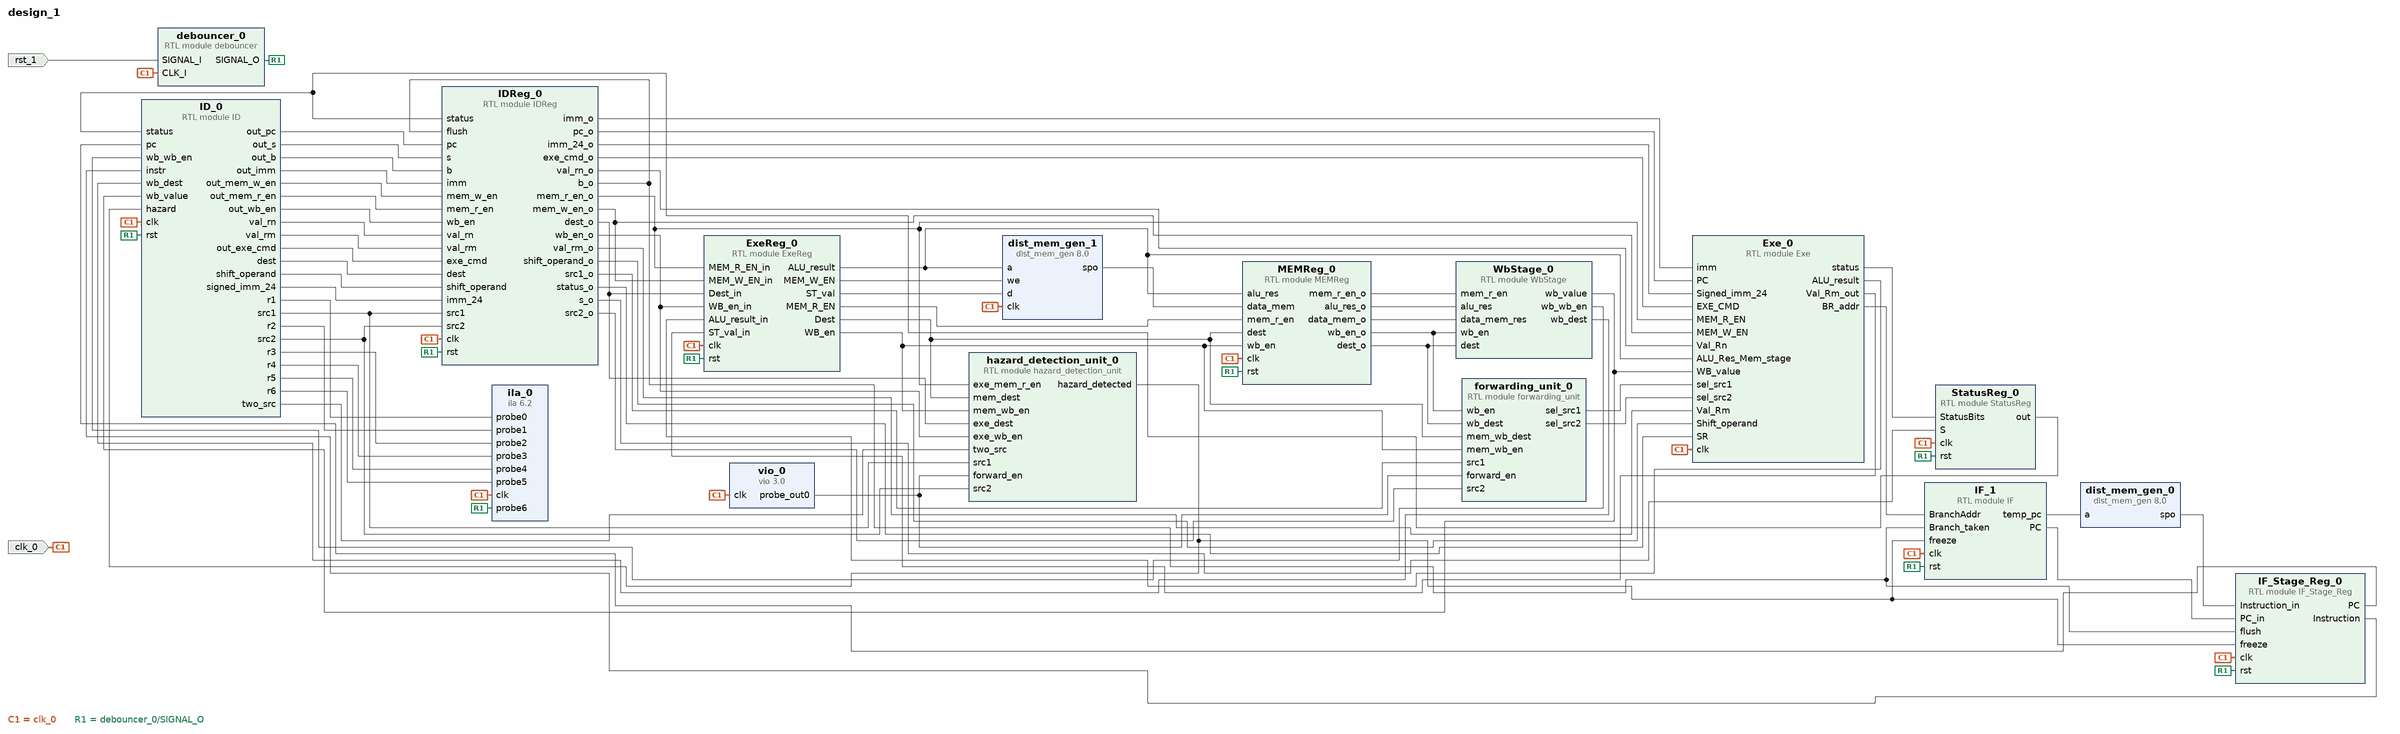
[diagram p0: block diagram of the top level]
# Vivado block design design_1, xc7z010clg400-1, Vivado 2018.3
create_bd_design design_1

create_bd_port -dir I -type clk clk_0
create_bd_port -dir I -type rst rst_1

create_bd_cell -type module -reference IF_Stage_Reg IF_Stage_Reg_0
create_bd_cell -type module -reference IF IF_1
create_bd_cell -type module -reference ExeReg ExeReg_0
create_bd_cell -type ip -vlnv xilinx.com:ip:dist_mem_gen:8.0 dist_mem_gen_0
set_property -dict [list \
  CONFIG.coefficient_file ../../../../../../vivado_phase1/output_ultimate.coe \
  CONFIG.data_width 32 \
  CONFIG.depth 8192 \
  CONFIG.memory_type rom \
] [get_bd_cells dist_mem_gen_0]
create_bd_cell -type ip -vlnv xilinx.com:ip:dist_mem_gen:8.0 dist_mem_gen_1
set_property -dict {CONFIG.data_width 32 CONFIG.depth 8192 CONFIG.memory_type single_port_ram} [get_bd_cells dist_mem_gen_1]
create_bd_cell -type module -reference MEMReg MEMReg_0
create_bd_cell -type module -reference WbStage WbStage_0
create_bd_cell -type module -reference StatusReg StatusReg_0
create_bd_cell -type ip -vlnv xilinx.com:ip:ila:6.2 ila_0
set_property -dict [list \
  CONFIG.C_ENABLE_ILA_AXI_MON false \
  CONFIG.C_MONITOR_TYPE Native \
  CONFIG.C_NUM_OF_PROBES 7 \
  CONFIG.C_PROBE0_TYPE 1 \
  CONFIG.C_PROBE0_WIDTH 32 \
  CONFIG.C_PROBE1_TYPE 1 \
  CONFIG.C_PROBE1_WIDTH 32 \
  CONFIG.C_PROBE2_TYPE 1 \
  CONFIG.C_PROBE2_WIDTH 32 \
  CONFIG.C_PROBE3_TYPE 1 \
  CONFIG.C_PROBE3_WIDTH 32 \
  CONFIG.C_PROBE4_TYPE 1 \
  CONFIG.C_PROBE4_WIDTH 32 \
  CONFIG.C_PROBE5_TYPE 1 \
  CONFIG.C_PROBE5_WIDTH 32 \
  CONFIG.C_PROBE6_TYPE 2 \
] [get_bd_cells ila_0]
create_bd_cell -type module -reference ID ID_0
create_bd_cell -type module -reference IDReg IDReg_0
create_bd_cell -type module -reference Exe Exe_0
create_bd_cell -type module -reference forwarding_unit forwarding_unit_0
create_bd_cell -type ip -vlnv xilinx.com:ip:vio:3.0 vio_0
set_property -dict {CONFIG.C_NUM_PROBE_IN 0} [get_bd_cells vio_0]
create_bd_cell -type module -reference debouncer debouncer_0
create_bd_cell -type module -reference hazard_detection_unit hazard_detection_unit_0

# ---- connections ----

connect_bd_net -net clk_0_1 [get_bd_ports clk_0] \
  [get_bd_pins IF_Stage_Reg_0/clk] [get_bd_pins IF_1/clk] [get_bd_pins ExeReg_0/clk] [get_bd_pins MEMReg_0/clk] \
  [get_bd_pins dist_mem_gen_1/clk] [get_bd_pins StatusReg_0/clk] [get_bd_pins ila_0/clk] [get_bd_pins ID_0/clk] \
  [get_bd_pins IDReg_0/clk] [get_bd_pins Exe_0/clk] [get_bd_pins vio_0/clk] [get_bd_pins debouncer_0/CLK_I]
connect_bd_net [get_bd_pins IF_1/PC] [get_bd_pins IF_Stage_Reg_0/PC_in]
connect_bd_net [get_bd_pins ID_0/out_pc] [get_bd_pins IDReg_0/pc]
connect_bd_net [get_bd_pins IF_Stage_Reg_0/PC] [get_bd_pins ID_0/pc]
connect_bd_net [get_bd_pins IF_Stage_Reg_0/Instruction] [get_bd_pins ID_0/instr]
connect_bd_net [get_bd_pins ID_0/out_s] [get_bd_pins IDReg_0/s]
connect_bd_net [get_bd_pins ID_0/out_b] [get_bd_pins IDReg_0/b]
connect_bd_net [get_bd_pins ID_0/out_imm] [get_bd_pins IDReg_0/imm]
connect_bd_net [get_bd_pins ID_0/out_mem_w_en] [get_bd_pins IDReg_0/mem_w_en]
connect_bd_net [get_bd_pins ID_0/out_mem_r_en] [get_bd_pins IDReg_0/mem_r_en]
connect_bd_net [get_bd_pins ID_0/out_wb_en] [get_bd_pins IDReg_0/wb_en]
connect_bd_net [get_bd_pins ID_0/val_rn] [get_bd_pins IDReg_0/val_rn]
connect_bd_net [get_bd_pins ID_0/val_rm] [get_bd_pins IDReg_0/val_rm]
connect_bd_net [get_bd_pins ID_0/out_exe_cmd] [get_bd_pins IDReg_0/exe_cmd]
connect_bd_net [get_bd_pins ID_0/dest] [get_bd_pins IDReg_0/dest]
connect_bd_net [get_bd_pins ID_0/shift_operand] [get_bd_pins IDReg_0/shift_operand]
connect_bd_net [get_bd_pins ID_0/signed_imm_24] [get_bd_pins IDReg_0/imm_24]
connect_bd_net [get_bd_pins dist_mem_gen_0/spo] [get_bd_pins IF_Stage_Reg_0/Instruction_in]
connect_bd_net [get_bd_pins IF_1/temp_pc] [get_bd_pins dist_mem_gen_0/a]
connect_bd_net [get_bd_pins IDReg_0/imm_o] [get_bd_pins Exe_0/imm]
connect_bd_net [get_bd_pins IDReg_0/pc_o] [get_bd_pins Exe_0/PC]
connect_bd_net [get_bd_pins IDReg_0/imm_24_o] [get_bd_pins Exe_0/Signed_imm_24]
connect_bd_net [get_bd_pins IDReg_0/exe_cmd_o] [get_bd_pins Exe_0/EXE_CMD]
connect_bd_net [get_bd_pins IDReg_0/mem_r_en_o] \
  [get_bd_pins ExeReg_0/MEM_R_EN_in] [get_bd_pins Exe_0/MEM_R_EN] [get_bd_pins hazard_detection_unit_0/exe_mem_r_en]
connect_bd_net [get_bd_pins IDReg_0/mem_w_en_o] [get_bd_pins ExeReg_0/MEM_W_EN_in] [get_bd_pins Exe_0/MEM_W_EN]
connect_bd_net [get_bd_pins IDReg_0/val_rn_o] [get_bd_pins Exe_0/Val_Rn]
connect_bd_net [get_bd_pins IDReg_0/val_rm_o] [get_bd_pins Exe_0/Val_Rm]
connect_bd_net [get_bd_pins IDReg_0/shift_operand_o] [get_bd_pins Exe_0/Shift_operand]
connect_bd_net [get_bd_pins StatusReg_0/out] [get_bd_pins ID_0/status] [get_bd_pins IDReg_0/status]
connect_bd_net [get_bd_pins IDReg_0/status_o] [get_bd_pins Exe_0/SR]
connect_bd_net [get_bd_pins IDReg_0/dest_o] [get_bd_pins ExeReg_0/Dest_in] [get_bd_pins hazard_detection_unit_0/exe_dest]
connect_bd_net [get_bd_pins IDReg_0/wb_en_o] [get_bd_pins ExeReg_0/WB_en_in] [get_bd_pins hazard_detection_unit_0/exe_wb_en]
connect_bd_net [get_bd_pins IDReg_0/s_o] [get_bd_pins StatusReg_0/S]
connect_bd_net [get_bd_pins IDReg_0/b_o] [get_bd_pins IF_1/Branch_taken] [get_bd_pins IF_Stage_Reg_0/flush] [get_bd_pins IDReg_0/flush]
connect_bd_net [get_bd_pins Exe_0/status] [get_bd_pins StatusReg_0/StatusBits]
connect_bd_net [get_bd_pins Exe_0/ALU_result] [get_bd_pins ExeReg_0/ALU_result_in]
connect_bd_net [get_bd_pins Exe_0/BR_addr] [get_bd_pins IF_1/BranchAddr]
connect_bd_net [get_bd_pins ExeReg_0/MEM_R_EN] [get_bd_pins MEMReg_0/mem_r_en]
connect_bd_net [get_bd_pins ExeReg_0/ALU_result] [get_bd_pins MEMReg_0/alu_res] [get_bd_pins dist_mem_gen_1/a] [get_bd_pins Exe_0/ALU_Res_Mem_stage]
connect_bd_net [get_bd_pins ExeReg_0/MEM_W_EN] [get_bd_pins dist_mem_gen_1/we]
connect_bd_net [get_bd_pins dist_mem_gen_1/spo] [get_bd_pins MEMReg_0/data_mem]
connect_bd_net [get_bd_pins ExeReg_0/Dest] \
  [get_bd_pins MEMReg_0/dest] [get_bd_pins forwarding_unit_0/mem_wb_dest] [get_bd_pins hazard_detection_unit_0/mem_dest]
connect_bd_net [get_bd_pins ExeReg_0/WB_en] \
  [get_bd_pins MEMReg_0/wb_en] [get_bd_pins forwarding_unit_0/mem_wb_en] [get_bd_pins hazard_detection_unit_0/mem_wb_en]
connect_bd_net [get_bd_pins MEMReg_0/wb_en_o] [get_bd_pins WbStage_0/wb_en] [get_bd_pins forwarding_unit_0/wb_en]
connect_bd_net [get_bd_pins MEMReg_0/mem_r_en_o] [get_bd_pins WbStage_0/mem_r_en]
connect_bd_net [get_bd_pins MEMReg_0/dest_o] [get_bd_pins WbStage_0/dest] [get_bd_pins forwarding_unit_0/wb_dest]
connect_bd_net [get_bd_pins MEMReg_0/alu_res_o] [get_bd_pins WbStage_0/alu_res]
connect_bd_net [get_bd_pins MEMReg_0/data_mem_o] [get_bd_pins WbStage_0/data_mem_res]
connect_bd_net [get_bd_pins WbStage_0/wb_wb_en] [get_bd_pins ID_0/wb_wb_en]
connect_bd_net [get_bd_pins WbStage_0/wb_dest] [get_bd_pins ID_0/wb_dest]
connect_bd_net [get_bd_pins WbStage_0/wb_value] [get_bd_pins ID_0/wb_value] [get_bd_pins Exe_0/WB_value]
connect_bd_net [get_bd_pins hazard_detection_unit_0/hazard_detected] \
  [get_bd_pins IF_Stage_Reg_0/freeze] [get_bd_pins IF_1/freeze] [get_bd_pins ID_0/hazard]
connect_bd_net [get_bd_pins ID_0/two_src] [get_bd_pins hazard_detection_unit_0/two_src]
connect_bd_net [get_bd_pins ID_0/src1] [get_bd_pins IDReg_0/src1] [get_bd_pins hazard_detection_unit_0/src1]
connect_bd_net [get_bd_pins ID_0/src2] [get_bd_pins IDReg_0/src2] [get_bd_pins hazard_detection_unit_0/src2]
connect_bd_net [get_bd_pins ExeReg_0/ST_val] [get_bd_pins dist_mem_gen_1/d]
connect_bd_net [get_bd_pins ID_0/r1] [get_bd_pins ila_0/probe0]
connect_bd_net [get_bd_pins ID_0/r2] [get_bd_pins ila_0/probe1]
connect_bd_net [get_bd_pins ID_0/r3] [get_bd_pins ila_0/probe2]
connect_bd_net [get_bd_pins ID_0/r4] [get_bd_pins ila_0/probe3]
connect_bd_net [get_bd_pins ID_0/r5] [get_bd_pins ila_0/probe4]
connect_bd_net [get_bd_pins ID_0/r6] [get_bd_pins ila_0/probe5]
connect_bd_net [get_bd_pins Exe_0/Val_Rm_out] [get_bd_pins ExeReg_0/ST_val_in]
connect_bd_net -net forward_en_0_1 [get_bd_pins vio_0/probe_out0] \
  [get_bd_pins forwarding_unit_0/forward_en] [get_bd_pins hazard_detection_unit_0/forward_en]
connect_bd_net [get_bd_pins IDReg_0/src1_o] [get_bd_pins forwarding_unit_0/src1]
connect_bd_net [get_bd_pins IDReg_0/src2_o] [get_bd_pins forwarding_unit_0/src2]
connect_bd_net [get_bd_pins forwarding_unit_0/sel_src1] [get_bd_pins Exe_0/sel_src1]
connect_bd_net [get_bd_pins forwarding_unit_0/sel_src2] [get_bd_pins Exe_0/sel_src2]
connect_bd_net -net rst_1_1 [get_bd_pins debouncer_0/SIGNAL_O] \
  [get_bd_pins StatusReg_0/rst] [get_bd_pins IF_Stage_Reg_0/rst] [get_bd_pins IF_1/rst] [get_bd_pins ExeReg_0/rst] \
  [get_bd_pins MEMReg_0/rst] [get_bd_pins ID_0/rst] [get_bd_pins ila_0/probe6] [get_bd_pins IDReg_0/rst]
connect_bd_net -net rst_1_2 [get_bd_ports rst_1] [get_bd_pins debouncer_0/SIGNAL_I]

validate_bd_design
save_bd_design
